# Altium schematic sheet interfaces.SchDoc
size A4
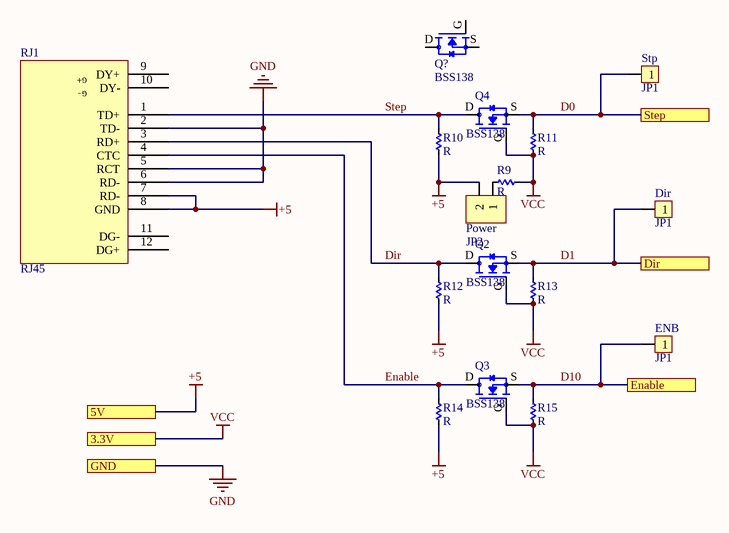
[diagram p0: interfaces.SchDoc]

## Parts
Dir  JP1  [JP1-D1T]
ENB  JP1  [JP1-D1T]
Power  JP2  [JP2-CLOSED]
Q2  BSS138  [SOT23-bss138]
Q3  BSS138  [SOT23-bss138]
Q4  BSS138  [SOT23-bss138]
Q?  BSS138  [SOT23-bss138]
R9  R  [RES-SMD-0603_BIG]
R10  R  [RES-SMD-0603_BIG]
R11  R  [RES-SMD-0603_BIG]
R12  R  [RES-SMD-0603_BIG]
R13  R  [RES-SMD-0603_BIG]
R14  R  [RES-SMD-0603_BIG]
R15  R  [RES-SMD-0603_BIG]
RJ1  RJ45  [RJ45-Dung]
Stp  JP1  [JP1-D1T]

## Ports
3.3V, 5V, Dir, Enable, GND, Step

## Nets
+5: Power.2 R10.2 R12.2 R14.2 RJ1.7(RD-) RJ1.8(GND) ; port 5V
GND: RJ1.2(TD-) RJ1.5(RCT) RJ1.6(RD-) ; port GND
VCC: Q2.G Q3.G Q4.G R9.2 R11.2 R13.2 R15.2 ; port 3.3V
D0: Q4.S R11.1 Stp.1 ; port Step
D1: Dir.1 Q2.S R13.1 ; port Dir
D10: ENB.1 Q3.S R15.1 ; port Enable
Dir: Q2.D R12.1 RJ1.3(RD+)
Enable: Q3.D R14.1 RJ1.4(CTC)
Step: Q4.D R10.1 RJ1.1(TD+)
NetPower_1: Power.1 R9.1

Not connected (* = marked no-connect by the designer): Q? D G S; RJ1 9(DY+) 10(DY-) 11(DG-) 12(DG+)

## Notes on the sheet
- (in symbol CON JR45) G+; G-

## Library data of the parts
Dir ENB Stp = JP1: WR-PHD 2.54 mm Angled Socket Header; Manufacturer: W¨¹rth Elektronik eiSos GmbH; partNo: 613002143121; ComponentLink1 Description: Manufacturer; ComponentLink2 Description: Datasheet; NoPins: 02; Created Date: 29 March 2013; ComponentLink1URL: http://www.we-online.com; ComponentLink2URL: http://katalog.we-online.de/em/datasheet/6130xx143121.pdf; Created by: Karrer Zheng
Power = JP2: WR-PHD 2.54 mm Angled Socket Header; Manufacturer: W¨¹rth Elektronik eiSos GmbH; partNo: 613002143121; ComponentLink1 Description: Manufacturer; ComponentLink2 Description: Datasheet; NoPins: 02; Created Date: 29 March 2013; ComponentLink1URL: http://www.we-online.com; ComponentLink2URL: http://katalog.we-online.de/em/datasheet/6130xx143121.pdf; Created by: Karrer Zheng
Q2-Q4 Q? = BSS138: N-Channel 50V 220mA _Ta_ 360mW _Ta_ Surface Mount Die; MF: MICROSS/On Semiconductor; Value: *; SnapEDA_Link: https://www.snapeda.com/parts/BSS138/MICROSS/On%20Semiconductor/view-part/2773844/?ref=snap; MP: BSS138; Availability: Unavailable; Price: None; Package: TO-236-3 Micross
RJ1 = CON JR45: ComponentLink1Description: Mua; ComponentLink1URL: https://thegioiic.com/products/rj45-top-cong-rj45-top-180-do